# EAGLE design Full_PCB_header_alone (EAGLE 8.0.0)
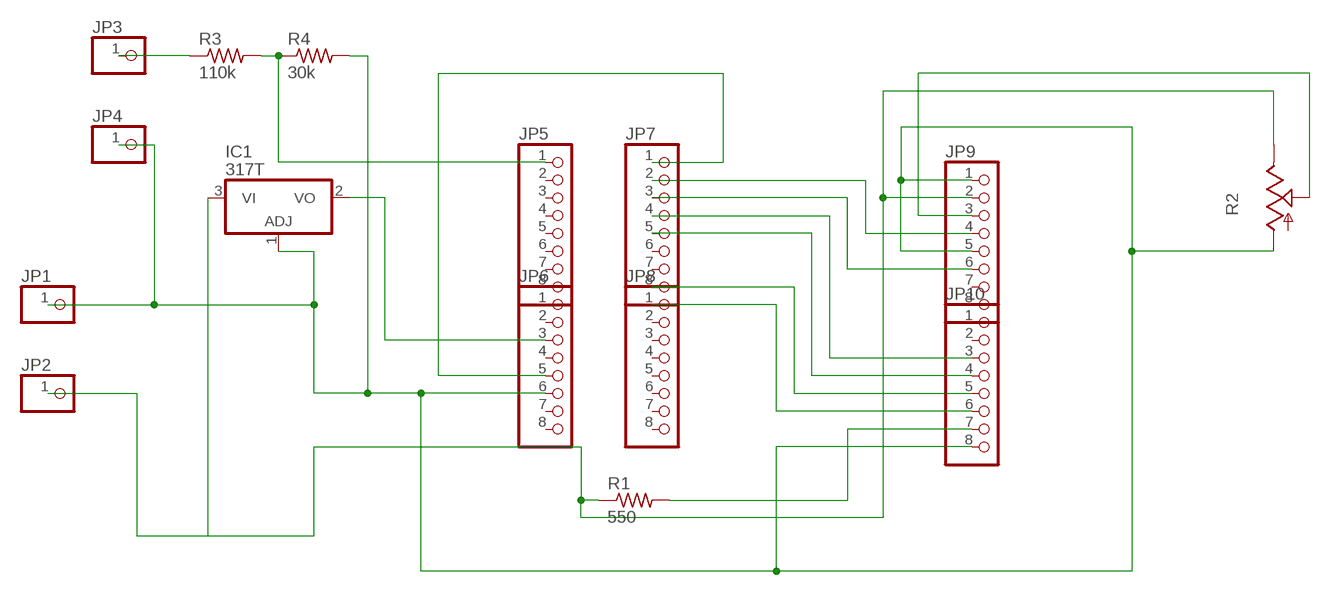
[diagram p0: schematic, sheet 1]

## Parts
IC1  317T  [TO220H]
JP1  PINHD-1X1  [1X01]
JP2  PINHD-1X1  [1X01]
JP3  PINHD-1X1  [1X01]
JP4  PINHD-1X1  [1X01]
JP5  PINHD-1X8  [1X08]
JP6  PINHD-1X8  [1X08]
JP7  PINHD-1X8  [1X08]
JP8  PINHD-1X8  [1X08]
JP9  PINHD-1X8  [1X08]
JP10  PINHD-1X8  [1X08]
R1  550  R-US_0207/10  [0207/10]
R2  TRIM_US-B25U  [B25U]
R3  110k  R-US_0207/10  [0207/10]
R4  30k  R-US_0207/10  [0207/10]

## Nets
N$1: JP5.1 R3.2 R4.1
N$2: IC1.3(VI) JP2.1 JP9.2 R1.1 R2.E
N$3: JP7.2 JP9.4
N$4: JP10.7 R1.2
N$5: JP7.3 JP9.6
N$6: JP7.4 JP10.3
N$7: JP7.5 JP10.4
N$8: JP7.8 JP10.5
N$9: JP8.1 JP10.6
N$10: IC1.2(VO) JP6.3
N$11: JP6.5 JP7.1
N$12: JP9.3 R2.S
N$14: JP3.1 R3.1
N$15: IC1.1(ADJ) JP1.1 JP4.1 JP6.6 JP9.1 JP9.5 JP10.8 R2.A R4.2
Unconnected: JP5.2 JP5.3 JP5.4 JP5.5 JP5.6 JP5.7 JP5.8 JP6.1 JP6.2 JP6.4 JP6.7 JP6.8 JP7.6 JP7.7 JP8.2 JP8.3 JP8.4 JP8.5 JP8.6 JP8.7 JP8.8 JP9.7 JP9.8 JP10.1 JP10.2

## Library data of the parts
IC1 = linear:*317: Positive VOLTAGE REGULATOR
JP1-JP4 = pinhead:PINHD-1X1: PIN HEADER
JP5-JP10 = pinhead:PINHD-1X8: PIN HEADER
R1 R3 R4 = rcl:R-US_: RESISTOR, American symbol
R2 = pot:TRIM_US-: POTENTIOMETER

## Board
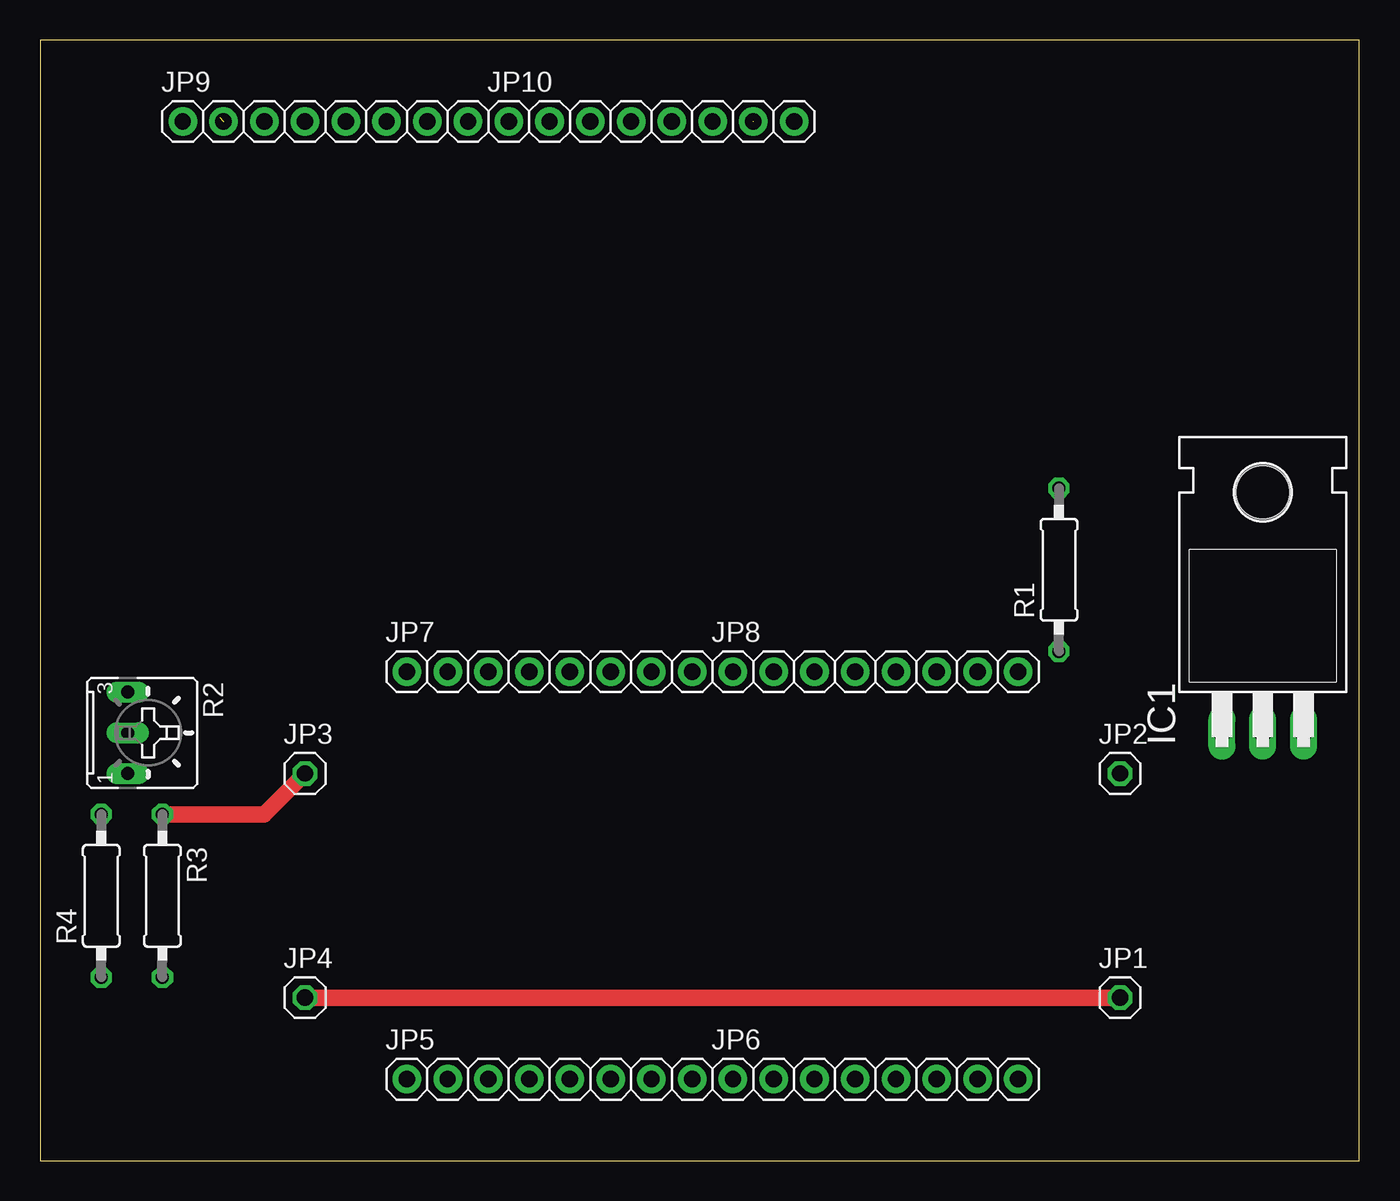
[diagram p1: board, top side]
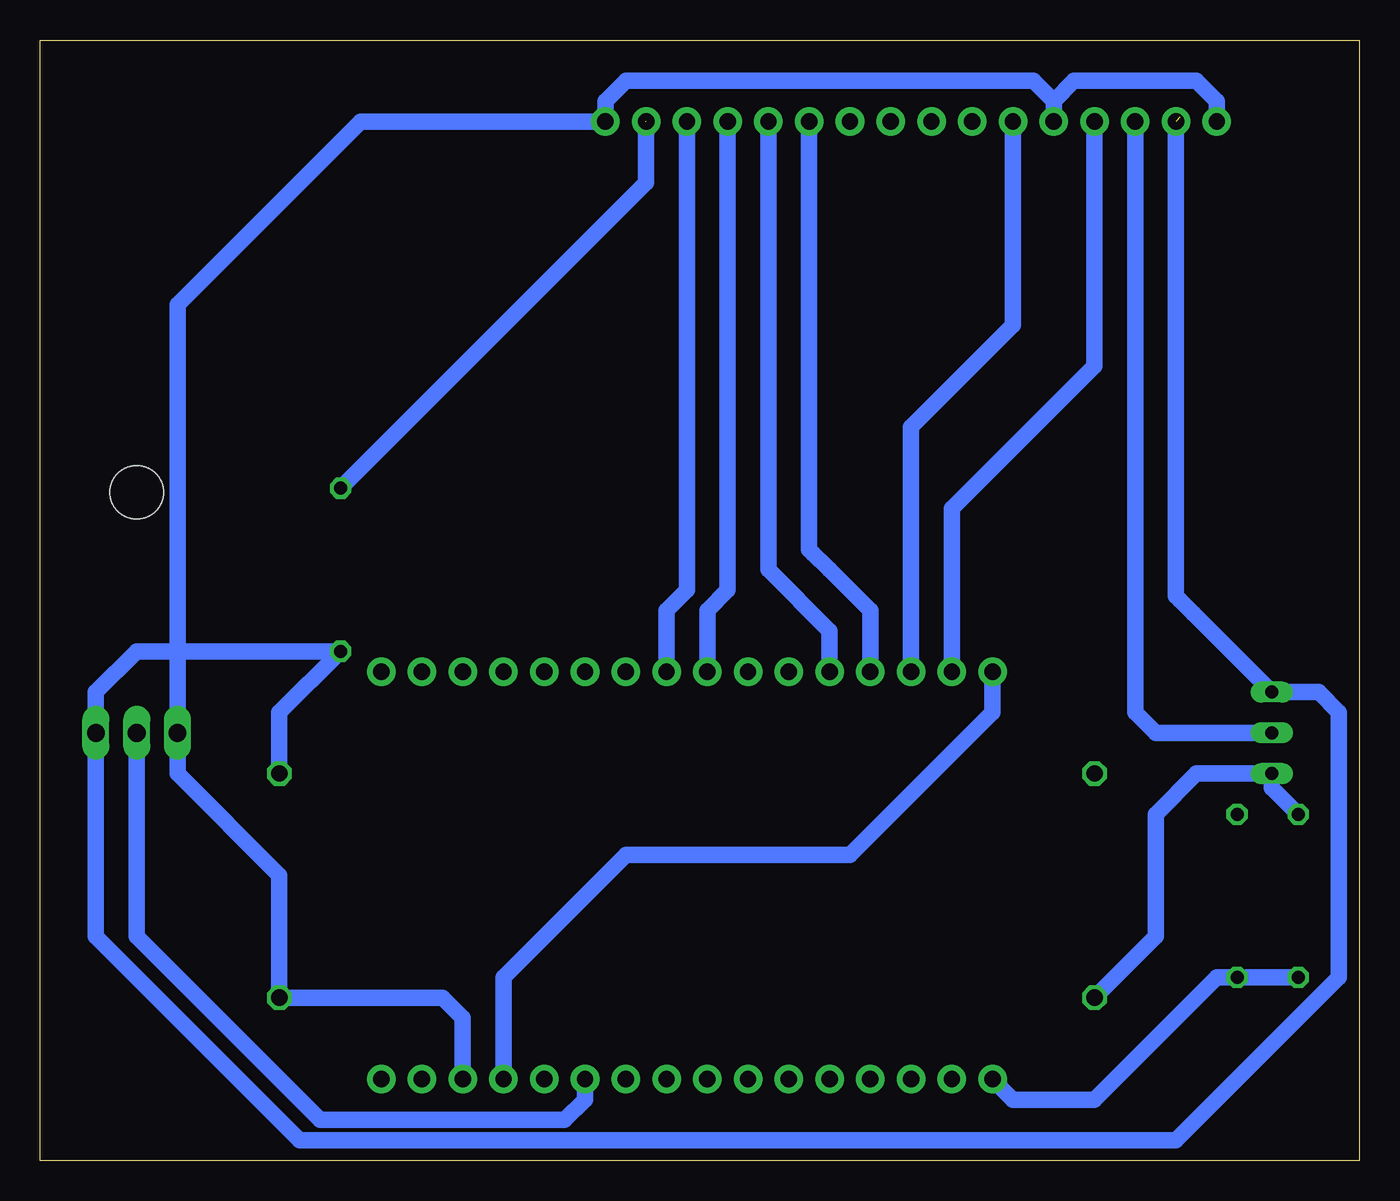
[diagram p2: board, bottom side, seen from below]

Size 82.22 x 69.84 mm. Coordinates in mm from the lower left corner, seen from the top.
Outline: 0,0 82.22,0 82.22,69.84 0,69.84 0,0
Copper layers (1*16): Top 0.035mm / dielectric 1.5mm / Bottom 0.035mm
Design rules "default": minimum track width 10mil, minimum drill 24mil, track to track 8mil, track to pad 8mil, pad to pad 8mil, via to via 8mil, smd to smd 8mil, copper to edge 40mil, drill to drill 8mil, minimum pad ring 10mil, minimum via ring 8mil, stop-mask expansion 4mil, vias tented up to drill 0mil, thermal gap 10mil

### Footprints (pad centres in the part's own frame; a part is rotated, then mirrored left to right if it is on the bottom)
TO220H = drill 1.118 long: 1 -2.54,-10.16; 2 0,-10.16; 3 2.54,-10.16 | hole 3.302: 0,4.826
1X01 = drill 1.016 octagon: 1 0,0
1X08 = drill 1.016 pad 1.778: 1 -8.89,0; 2 -6.35,0; 3 -3.81,0; 4 -1.27,0; 5 1.27,0; 6 3.81,0; 7 6.35,0; 8 8.89,0
0207/10 = drill 0.813 octagon: 1 -5.08,0; 2 5.08,0
B25U = drill 0.813 long: A 2.54,-0.889; E -2.54,-0.889; S 0,-0.889

### Placement (x,y rotation side)
IC1  76.2,36.83 0 top
JP1  67.31,10.16 0 top
JP2  67.31,24.13 0 top
JP3  16.51,24.13 0 top
JP4  16.51,10.16 0 top
JP5  31.75,5.08 0 top
JP6  52.07,5.08 0 top
JP7  31.75,30.48 0 top
JP8  52.07,30.48 0 top
JP9  17.78,64.77 0 top
JP10  38.1,64.77 0 top
R1  63.5,36.83 90 top
R2  6.35,26.67 270 top
R3  7.62,16.51 270 top
R4  3.81,16.51 90 top

### Tracks (layer width: path | path; a pad name or v marks a point on that pad's centre or on a via)
N$1
  Bottom 1.016: R4.1 R3.2 8.89,11.43 16.51,3.81 21.59,3.81 JP5.1
N$2  (1 unrouted)
  Bottom 1.016: JP2.1 67.31,27.94 R1.1 76.2,31.75 78.74,29.21 IC1.3 78.74,13.97 66.04,1.27 11.43,1.27 1.27,11.43 1.27,27.94 2.54,29.21 R2.E 10.35,34.1 11.18,34.93 11.43,35.18 JP9.2
N$3
  Bottom 1.016: JP7.2 25.4,40.64 16.51,49.53 JP9.4
N$4  (1 unrouted)
  Bottom 1.016: 44.45,63.5 JP10.7 | JP10.7 44.45,60.96 R1.2
N$5
  Bottom 1.016: JP9.6 21.59,52.07 27.94,45.72 JP7.3
N$6
  Bottom 1.016: 33.02,36.83 34.04,37.85 | 33.02,36.83 30.48,34.29 JP7.4 | JP10.3 34.29,62.23 | 34.29,62.23 34.29,61.21 | 34.29,62.23 34.29,38.1 33.02,36.83
N$7
  Bottom 1.016: JP10.4 36.83,36.83 33.02,33.02 JP7.5
N$8
  Bottom 1.016: JP7.8 40.64,34.29 39.37,35.56 JP10.5
N$9
  Bottom 1.016: JP8.1 43.18,34.29 41.91,35.56 JP10.6
N$10
  Bottom 1.016: JP6.3 48.26,3.81 49.53,2.54 64.77,2.54 76.2,13.97 IC1.2
N$11
  Bottom 1.016: 22.86,29.21 JP7.1 22.86,29.21 | 22.86,29.21 22.86,27.94 31.75,19.05 45.72,19.05 53.34,11.43 JP6.5
N$12
  Bottom 1.016: R2.S 12.7,26.67 13.97,27.94 JP9.3
N$14
  Top 1.016: R3.1 13.97,21.59 JP3.1
N$15
  Top 1.016: JP4.1 JP1.1
  Bottom 1.016: JP4.1 12.7,13.97 12.7,21.59 10.16,24.13 R2.A 5.46,23.24 R4.2 | JP6.6 55.88,8.89 57.15,10.16 JP1.1 67.31,17.78 73.66,24.13 IC1.1 73.66,53.34 62.23,64.77 JP10.8 46.99,66.04 45.72,67.31 20.32,67.31 19.05,66.04 | JP9.1 8.89,66.04 10.16,67.31 17.78,67.31 19.05,66.04 | 19.05,66.04 JP9.5 19.05,66.04